# Altium schematic sheet eFuse.SchDoc
size 420 x 297 mm; Revision: 1.1.0; SheetNumber: 4; SheetTotal: 15
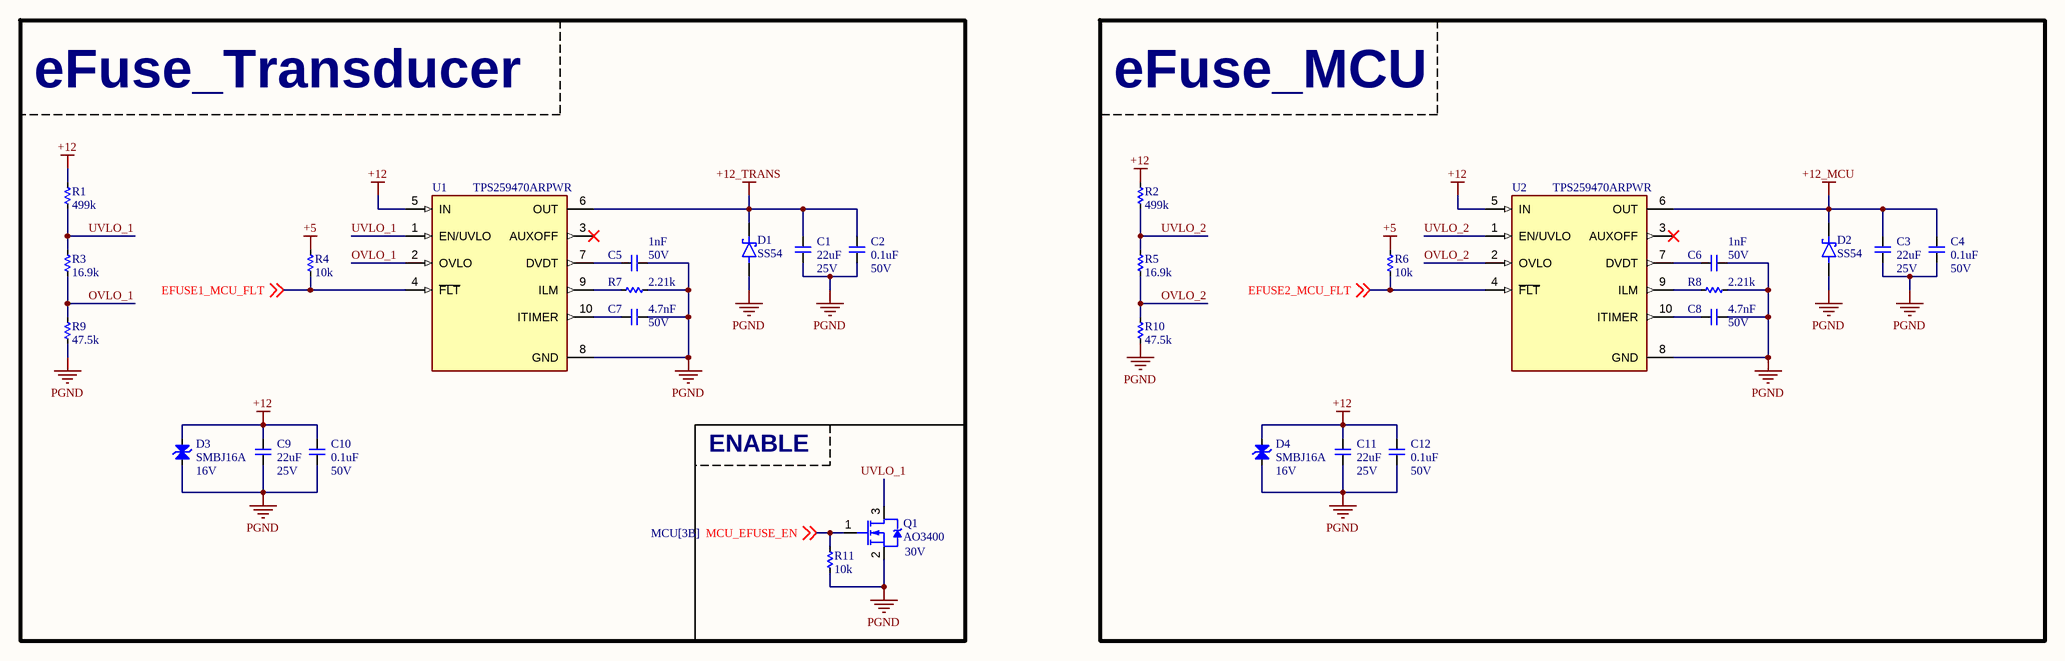
[diagram p0: eFuse.SchDoc]

## Parts
C1  22uF  Voltage: 25V  [CAP_C_2012X110]
C2  0.1uF  Voltage: 50V  [CAP_C_1608X80]
C3  22uF  Voltage: 25V  [CAP_C_2012X110]
C4  0.1uF  Voltage: 50V  [CAP_C_1608X80]
C5  1nF  Voltage: 50V  [CAP_C_1608X80]
C6  1nF  Voltage: 50V  [CAP_C_1608X80]
C7  4.7nF  Voltage: 50V  [CAP_C_1608X80]
C8  4.7nF  Voltage: 50V  [CAP_C_1608X80]
C9  22uF  Voltage: 25V  [CAP_C_2012X110]
C10  0.1uF  Voltage: 50V  [CAP_C_1608X80]
C11  22uF  Voltage: 25V  [CAP_C_2012X110]
C12  0.1uF  Voltage: 50V  [CAP_C_1608X80]
D1  SS54  [DO-214AC_SMA]
D2  SS54  [DO-214AC_SMA]
D3  SMBJ16A  Voltage: 16V  [DO-214AA_SMB]
D4  SMBJ16A  Voltage: 16V  [DO-214AA_SMB]
Q1  AO3400  Voltage: 30V  [SOT-23]
R1  499k  [RES_C_1608X60]
R2  499k  [RES_C_1608X60]
R3  16.9k  [RES_C_1608X60]
R4  10k  [RES_C_1608X60]
R5  16.9k  [RES_C_1608X60]
R6  10k  [RES_C_1608X60]
R7  2.21k  [RES_C_1608X60]
R8  2.21k  [RES_C_1608X60]
R9  47.5k  [RES_C_1608X60]
R10  47.5k  [RES_C_1608X60]
R11  10k  [RES_C_1608X60]
U1  TPS259470ARPWR  [TPS259474]
U2  TPS259470ARPWR  [TPS259474]

## Blocks framed on the sheet
eFuse_Transducer: C1 C2 C5 C7 C9 C10 D1 D3 Q1 R1 R3 R4 R7 R9 R11 U1
eFuse_MCU: C3 C4 C6 C8 C11 C12 D2 D4 R2 R5 R6 R8 R10 U2

## Nets
+5: R4.1 R6.1
+12: C9.2 C10.2 C11.2 C12.2 D3.1(A) D4.1(A) R1.2 R2.2 U1.5(IN) U2.5(IN)
+12_MCU: C3.2 C4.1 D2.1(K) U2.6(OUT)
+12_TRANS: C1.2 C2.1 D1.1(K) U1.6(OUT)
PGND: C1.1 C2.2 C3.1 C4.2 C5.2 C6.2 C7.2 C8.2 C9.1 C10.1 C11.1 C12.1 D1.2(A) D2.2(A) D3.2(K) D4.2(K) Q1.2(S) R7.2 R8.2 R9.1 R10.1 R11.2 U1.8(GND) U2.8(GND)
EFUSE1_MCU_FLT: R4.2 U1.4(~{FLT}) ; off-sheet EFUSE1_MCU_FLT
EFUSE2_MCU_FLT: R6.2 U2.4(~{FLT}) ; off-sheet EFUSE2_MCU_FLT
MCU_EFUSE_EN: Q1.1(G) R11.1 ; off-sheet MCU_EFUSE_EN
OVLO_1: R3.1 R9.2 U1.2(OVLO)
OVLO_2: R5.1 R10.2 U2.2(OVLO)
UVLO_1: Q1.3(D) R1.1 R3.2 U1.1(EN/UVLO)
UVLO_2: R2.1 R5.2 U2.1(EN/UVLO)
NetC5_1: C5.1 U1.7(DVDT)
NetC6_1: C6.1 U2.7(DVDT)
NetC7_1: C7.1 U1.10(ITIMER)
NetC8_1: C8.1 U2.10(ITIMER)
NetR7_1: R7.1 U1.9(ILM)
NetR8_1: R8.1 U2.9(ILM)

Not connected (* = marked no-connect by the designer): U1 3(AUXOFF)*; U2 3(AUXOFF)*

## Notes on the sheet
- ENABLE
- Project:
- DAL_PDU
- Sub-system:
- IGRVT-50
- Design by:
- KIEN HOANG
- BAO BUI
- Sheet title:
- Sheet
- A3
- of
- Checked by:
- Approved by:
- VU PHAM
- Revision:
- Document No:
- Size:
- Date:

## Library data of the parts
C1-C12 = _CAP_C_2: CAP
D1 D2 = DIODE SCHOTTKY
D3 D4 = Diode TVS: TVS Diode; Code - JEDEC: DO-214-AB; Value: 1N5007; Published: 8-Jun-2000; Revision: July-2002: Re-released for DXP Platform.; Publisher: Altium Limited
Q1 = Mosfet N
R1-R11 = _RES_B_2_2: RES